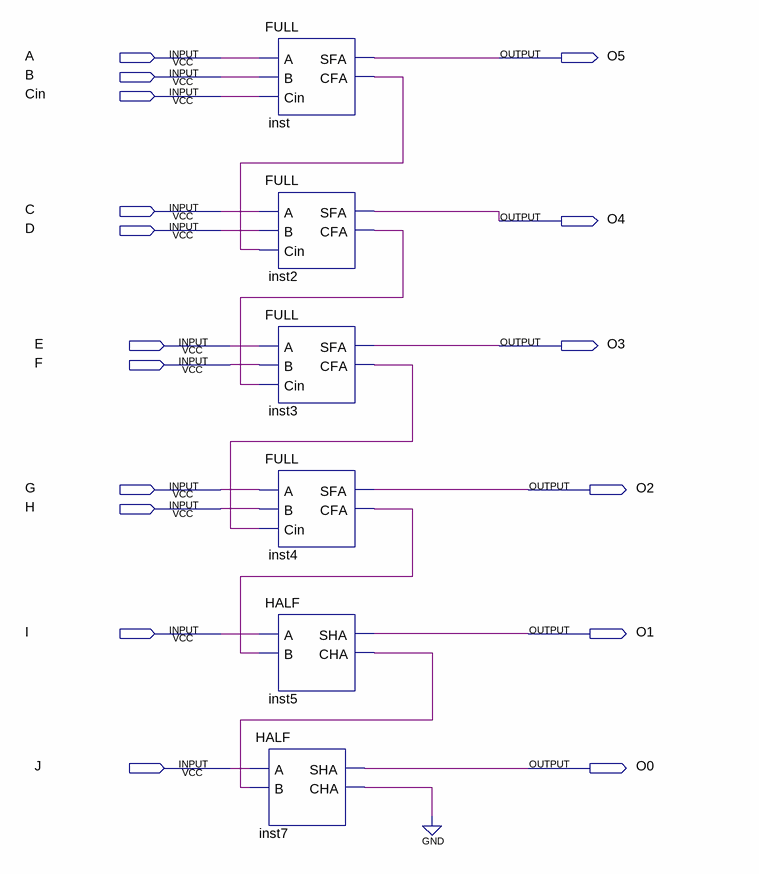
[diagram p0: schematic sheet]
// Quartus schematic RCASIX.bdf as structural Verilog: 6 symbols, 17 pins
module RCASIX (
  input  A,
  input  B,
  input  Cin,
  input  C,
  input  D,
  input  E,
  input  F,
  input  G,
  input  H,
  input  I,
  input  J,
  output O5,
  output O4,
  output O3,
  output O2,
  output O1,
  output O0
);

  wire inst2_cfa, inst3_cfa, inst4_cfa, inst5_cha, inst7_cha, inst_cfa;

  FULL inst (.A(A), .B(B), .Cin(Cin), .SFA(O5), .CFA(inst_cfa));
  FULL inst2 (.A(C), .B(D), .Cin(inst_cfa), .SFA(O4), .CFA(inst2_cfa));
  FULL inst3 (.A(E), .B(F), .Cin(inst2_cfa), .SFA(O3), .CFA(inst3_cfa));
  FULL inst4 (.A(G), .B(H), .Cin(inst3_cfa), .SFA(O2), .CFA(inst4_cfa));
  HALF inst5 (.A(I), .B(inst4_cfa), .SHA(O1), .CHA(inst5_cha));
  HALF inst7 (.A(J), .B(inst5_cha), .SHA(O0), .CHA(inst7_cha));
  // also tied to GND on the sheet: inst7_cha
endmodule
